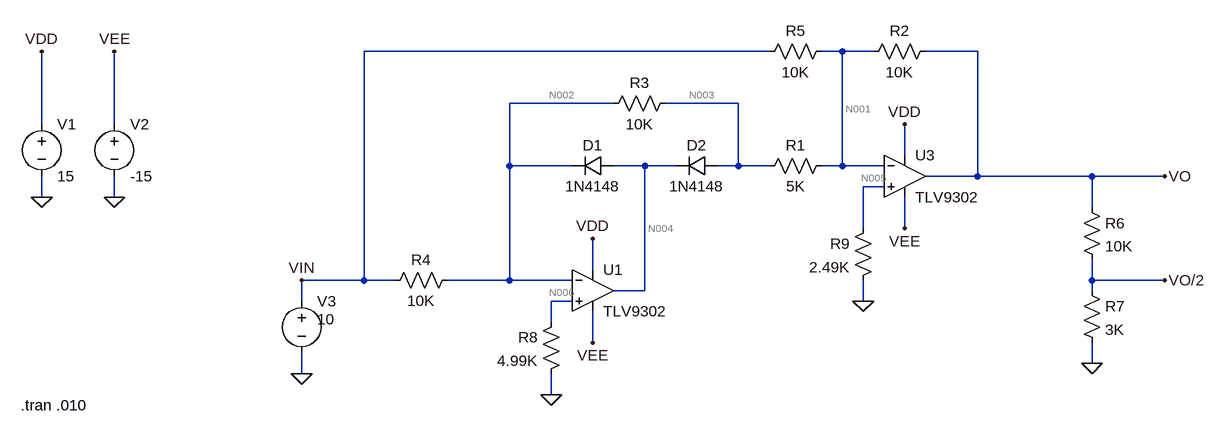
[diagram p0: schematic Absolute_Value.asc]
* Absolute_Value.asc
V1 VDD 0 15
V2 VEE 0 -15
D1 N004 N002 1N4148
D2 N003 N004 1N4148
R1 N001 N003 5K
R2 VO N001 10K
R3 N003 N002 10K
R4 N002 VIN 10K
R5 N001 VIN 10K
V3 VIN 0 10
R6 VO VO/2 10K
R7 VO/2 0 3K
* U3: TLV9302 (symbol Hab_OpAmp\TLV9302 not available, pins judged from their places): In+=N005 In-=N001 V+=VDD V-=VEE OUT=VO
* U1: TLV9302 (symbol Hab_OpAmp\TLV9302 not available, pins judged from their places): In+=N006 In-=N002 V+=VDD V-=VEE OUT=N004
R8 N006 0 4.99K
R9 N005 0 2.49K
.model D D
.lib standard.dio
.tran .010
.backanno
.end

* Results of the author's LTspice run, read from the files saved beside the schematic
* Operating Point, zero values left out:
*   V(vdd) = 15 V
*   V(vee) = -15 V
*   V(n004) = -10.64 V
*   V(n002) = 309.5 µV
*   V(n003) = -9.999 V
*   V(n001) = 291.7 µV
*   V(vo) = 10 V
*   V(vin) = 10 V
*   V(vo/2) = 2.308 V
*   V(n005) = -24.9 nV
*   V(n006) = -49.9 nV
*   I(D2) = 3 mA
*   I(D1) = -2.531 nA
*   I(R9) = -10 pA
*   I(R8) = -10 pA
*   I(R7) = 769.2 µA
*   I(R6) = 769.2 µA
*   I(R5) = -1 mA
*   I(R4) = -1 mA
*   I(R3) = -1 mA
*   I(R2) = 1 mA
*   I(R1) = 2 mA
*   I(V3) = -2 mA
*   I(V2) = 3.24 mA
*   I(V1) = -2.009 mA
*   Ix(u3:IN+) = 10 pA
*   Ix(u3:IN-) = 5.001 pA
*   Ix(u3:VCC) = 1.889 mA
*   Ix(u3:VEE) = -120 µA
*   Ix(u3:OUT) = -1.769 mA
*   Ix(u1:IN+) = 10 pA
*   Ix(u1:IN-) = 5.002 pA
*   Ix(u1:VCC) = 120 µA
*   Ix(u1:VEE) = -3.12 mA
*   Ix(u1:OUT) = 3 mA
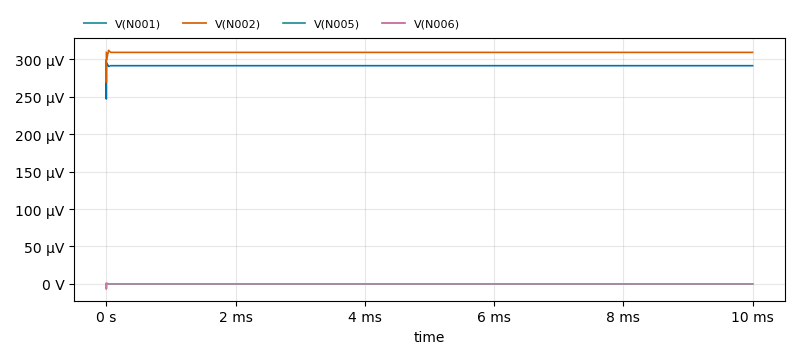
[diagram p1: Transient Analysis of Absolute_Value.asc, plotted from the saved traces]
* Transient Analysis, 1 run:
*   V(N001): min 247.1 µV, max 296.3 µV, average 291.7 µV, rms 291.7 µV, last 291.7 µV
*   V(N002): min 269.4 µV, max 312.2 µV, average 309.5 µV, rms 309.5 µV, last 309.5 µV
*   V(N005): min -6.656 µV, max 578.1 nV, average -24.41 nV, rms 39.47 nV, last -24.9 nV
*   V(N006): min -6.663 µV, max 998.9 nV, average -49.07 nV, rms 72.25 nV, last -49.9 nV